# Altium schematic sheet QUTMS-TSAL-NEW-S01.SchDoc: LED Driver
size A3; DrawnBy: Joseph Richards; DocumentNumber: 2; Revision: 2; SheetNumber: 2; SheetTotal: 5
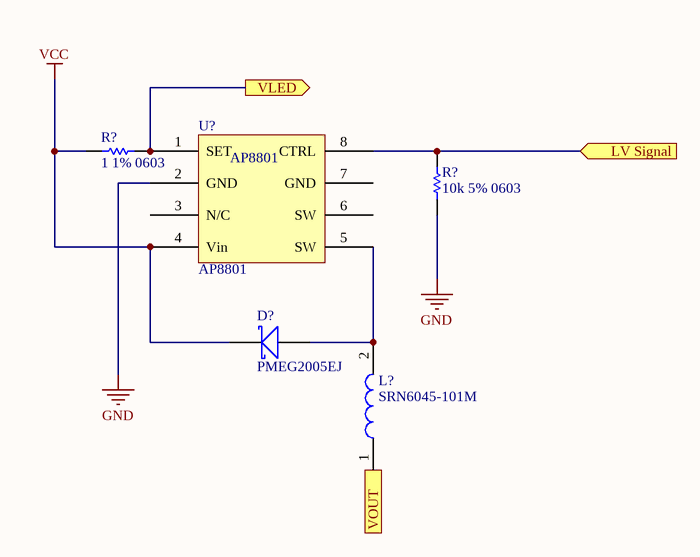
[diagram p0: QUTMS-TSAL-NEW-S01.SchDoc]

## Parts
(Parts that share a designator on the sheet are numbered #1, #2 ... from top to bottom, then left to right.)
D?  PMEG2005EJ  [SOD-323F(shottkey)]
L?  SRN6045-101M  [Bourns Inductor 6x6x4.5mm(100mH)]
R?#1  1 1% 0603  [Res_ThinFilm_0603 (1,10k)]
R?#2  10k 5% 0603  [Res_ThinFilm_0603 (1,10k)]
U?  AP8801  [SOP8/SO8(AP8801)]

## Ports
LV Signal (in), VLED (out), VOUT (in)

## Nets
GND: R?#2.1 U?.2(GND)
VCC: D?.K(Cathode) R?#1.1 U?.4(Vin)
LV Signal: R?#2.2 U?.8(CTRL) ; port LV Signal
VLED: R?#1.2 U?.1(SET) ; port VLED
VOUT: L?.1 ; port VOUT
NetD?_A: D?.A(Anode) L?.2 U?.5(SW)

Not connected (* = marked no-connect by the designer): U? 3(N/C) 6(SW) 7(GND)

## Notes on the sheet
- Revision History:
- Sheet Title:
- Rev
- Date
- Description
- Project:
- Size:
- Drawn By:
- A3
- Number:
- Revision:
- Sheet
- Version:
- of
- QUT Motorsport
- O-120, Gardens Point
- 2 George Street
- Brisbane, QLD 4000
- Australia
- Print Date:
- Print Time:
- File Name:

## Library data of the parts
D? = PMEG2005EJ: Diode, Schottky, SMD, 20 V, 500 mA, Single, SOD-323F, 2 Pins, 390 mV; ComponentLink1Description: Element14; ComponentLink1URL: https://au.element14.com/nexperia/pmeg2005ej-115/schottky-rect-20v-0-5a-sod323f/dp/1757760
L? = SRN6045-101M: Inductor, 100 µH, 700 mA, Semishielded, 800 mA, SRN6045 Series, 6mm x 6mm x 4.5mm; ComponentLink1Description: Element14; ComponentLink1URL: https://au.element14.com/bourns/srn6045-101m/inductor-100uh-semi-shielded-power/dp/2061658
R?#1 = 1 1% 0603: Resistor, SMD, 1, 0.1W, 1%, 0603
R?#2 = 10k 5% 0603: Resistor, SMD, 10k, 0.1W, 5%, 0603
U? = AP8801: the LED drver fotr the red and green LED's